# Altium schematic sheet Architecture.SchDoc: System Architecture
size 420 x 297 mm; SheetNumber: 1; SheetTotal: 2; DOC_NO_SCH_DWG: 1
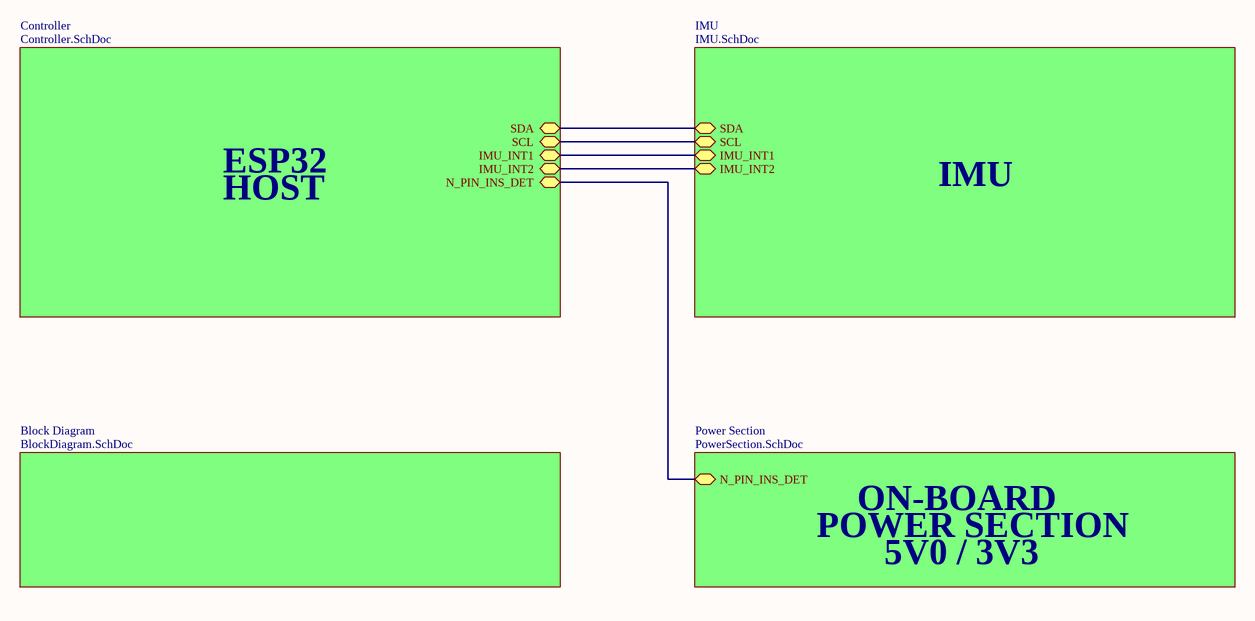
[diagram p0: Architecture.SchDoc]

## Sub-sheets
Block Diagram = BlockDiagram.SchDoc: no entries
Controller = Controller.SchDoc: SDA (bidir), SCL (bidir), IMU_INT1 (bidir), IMU_INT2 (bidir), N_PIN_INS_DET (bidir)
IMU = IMU.SchDoc: SDA (bidir), SCL (bidir), IMU_INT1 (bidir), IMU_INT2 (bidir)
Power Section = PowerSection.SchDoc: N_PIN_INS_DET (bidir)

## Nets
(unnamed): sheet Controller/SDA, sheet IMU/SDA
(unnamed): sheet Controller/SCL, sheet IMU/SCL
(unnamed): sheet Controller/IMU_INT1, sheet IMU/IMU_INT1
(unnamed): sheet Controller/IMU_INT2, sheet IMU/IMU_INT2
(unnamed): sheet Controller/N_PIN_INS_DET, sheet Power Section/N_PIN_INS_DET

## Notes on the sheet
- HOST
- ESP32
- IMU
- POWER SECTION
- ON-BOARD
- 5V0 / 3V3
- PROJECT
- SIZE
- FILE NAME
- A3
- TITLE
- SHEET
- OF
- REV